# EAGLE design joystick_connector_v1 (EAGLE 9.6.2)
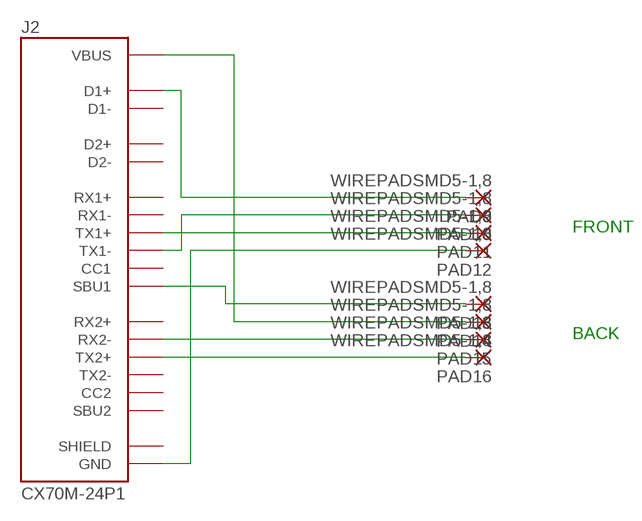
[diagram p0: schematic, sheet 1]

## Parts
J2  CX70M-24P1  [HRS_CX70M-24P1]
PAD9  WIREPADSMD5-1,8  [5-1,8]
PAD10  WIREPADSMD5-1,8  [5-1,8]
PAD11  WIREPADSMD5-1,8  [5-1,8]
PAD12  WIREPADSMD5-1,8  [5-1,8]
PAD13  WIREPADSMD5-1,8  [5-1,8]
PAD14  WIREPADSMD5-1,8  [5-1,8]
PAD15  WIREPADSMD5-1,8  [5-1,8]
PAD16  WIREPADSMD5-1,8  [5-1,8]

## Nets
N$1: J2.A6(D1+) PAD9.1(P)
N$2: J2.A3(TX1-) PAD10.1(P)
N$3: J2.A2(TX1+) PAD11.1(P)
N$4: J2.A1(GND) J2.A12(GND) J2.B1(GND) J2.B12(GND) PAD12.1(P)
N$5: J2.A8(SBU1) PAD13.1(P)
N$6: J2.A4(VBUS) J2.A9(VBUS) J2.B4(VBUS) J2.B9(VBUS) PAD14.1(P)
N$7: J2.A10(RX2-) PAD15.1(P)
N$8: J2.B2(TX2+) PAD16.1(P)
Unconnected: J2.A5(CC1) J2.A7(D1-) J2.A11(RX2+) J2.B3(TX2-) J2.B5(CC2) J2.B6(D2+) J2.B7(D2-) J2.B8(SBU2) J2.B10(RX1-) J2.B11(RX1+)

## Notes on the sheet
- FRONT
- BACK

## Power pins joined to a net without a drawn wire
SHIELD: J2.S1(SHIELD) J2.S2(SHIELD) J2.S3(SHIELD) J2.S4(SHIELD) J2.S5(SHIELD) J2.S5.1(SHIELD) J2.S6(SHIELD) J2.S6.1(SHIELD)

## Library data of the parts
J2 = CX70M-24P1:CX70M-24P1: Usb Connector, 3.1 Type c, Rcpt, Smt; MANUFACTURER: HRS; STANDARD: Manufacturer Recommendations
PAD9-PAD16 = wirepad:WIREPAD: Wire PAD connect wire on PCB

## Board
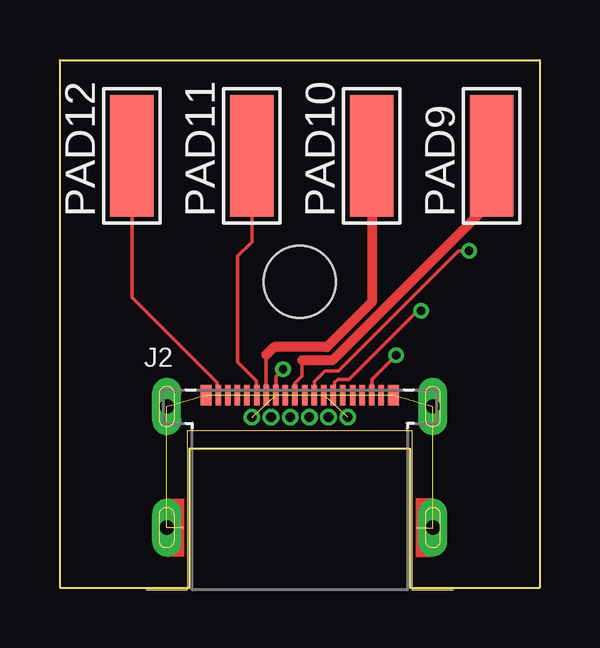
[diagram p1: board, top side]
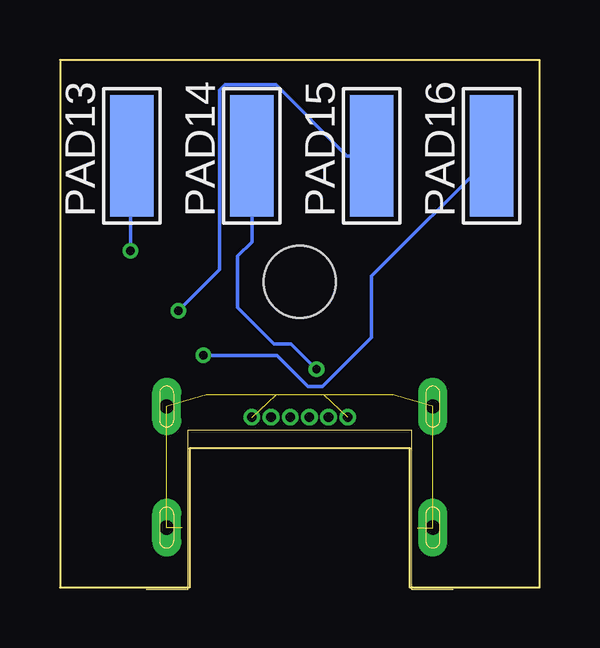
[diagram p2: board, bottom side, seen from below]

Size 20 x 22 mm. Coordinates in mm from the lower left corner, seen from the top.
Outline: 0,0 5.4,0 5.4,5.8 14.6,5.8 14.6,0 20,0 20,22 0,22 0,0
Copper layers (1*16): Top 0.035mm / dielectric 1.53mm / Bottom 0.035mm
Design rules "pban_5mil-l2": minimum track width 5mil, minimum drill 0.3mm, track to track 5mil, track to pad 0.229mm, pad to pad 5mil, via to via 5mil, smd to smd 5mil, copper to edge 0.5mm, drill to drill 0.5mm, minimum pad ring 0.15mm, minimum via ring 0.15mm, stop-mask expansion 4mil, vias tented up to drill 0.35mm, thermal gap 10mil
Holes 3 mm at 10,12.75

### Footprints (pad centres in the part's own frame; a part is rotated, then mirrored left to right if it is on the bottom)
HRS_CX70M-24P1 = smd 0.23 x 0.85: A1 -2.2,5.525; A2 -1.8,5.525; A3 -1.4,5.525; A4 -1,5.525; A5 -0.6,5.525; A6 -0.2,5.525; A7 0.2,5.525; A8 0.6,5.525; A9 1,5.525; A10 1.4,5.525; A11 1.8,5.525; A12 2.2,5.525; B1 3.4,5.525; B2 3,5.525; B3 2.6,5.525; B10 -2.6,5.525; B11 -3,5.525; B12 -3.4,5.525 | drill 0.4 pad 0.6: B4 2,4.6; B5 1.2,4.6; B6 0.4,4.6; B7 -0.4,4.6; B8 -1.2,4.6; B9 -2,4.6 | drill 0.6 pad 1.2 long: S1 -5.55,5.05; S4 5.55,5.05; S5 -5.55,0; S6 5.55,0 | smd 0.46 x 0.85: S2 -3.915,5.525; S3 3.915,5.525 | smd 0.1 x 0.1: S5.1 -4.9,0; S6.1 4.9,0
5-1,8 = smd 1.829 x 5.08: 1 0,0

### Placement (x,y rotation side)
J2  10,2.5 0 top
PAD9  18,18 0 top
PAD10  13,18 0 top
PAD11  8,18 0 top
PAD12  3,18 0 top
PAD13  17,18 0 bottom
PAD14  12,18 0 bottom
PAD15  7,18 0 bottom
PAD16  2,18 0 bottom

### Tracks (layer width: path | path; a pad name or v marks a point on that pad's centre or on a via)
N$1
  Top 0.152: J2.A6 9.8,8.53 10.1,8.82 10.1,9.47
  Top 0.406: 10.1,9.47 11.36,9.47 18,16.11 PAD9.1
N$2
  Top 0.152: 8.6,9.7 J2.A3
  Top 0.406: 8.6,9.7 8.93,10.03 11.13,10.03 13,11.9 PAD10.1
N$3
  Top 0.152: PAD11.1 8,14.42 7.41,13.82 7.41,9.41 8.19,8.62 J2.A2
N$4  (3 unrouted)
  Top 0.152: J2.B12 6.54,8.08 6.54,8.54 3,12.09 PAD12.1
N$5  (via drill 0.35)
  Top 0.152: v17.06,14.04 16.61,14.04 11.61,9.04 11.05,9.04 10.61,8.6 J2.A8
  Bottom 0.152: v17.06,14.04 17.06,17.94 PAD13.1
N$6  (via drill 0.35)  (3 unrouted)
  Top 0.152: J2.A4 9,8.8 v9.3,9.1
  Bottom 0.152: v9.3,9.1 10.36,10.16 11.07,10.16 12.59,11.68 12.59,13.82 12,14.42 PAD14.1
N$7  (via drill 0.35)
  Top 0.152: v15.07,11.53 14.91,11.53 12.05,8.68 11.59,8.68 11.46,8.54 11.46,8.08 J2.A10
  Bottom 0.152: PAD15.1 8.02,18 10.99,20.97 13.11,20.97 13.34,20.73 13.34,13.26 v15.07,11.53
N$8  (via drill 0.35)
  Top 0.152: J2.B2 13,8.67 v14.02,9.68
  Bottom 0.152: PAD16.1 7.01,12.99 7.01,10.43 9.05,8.39 9.65,8.39 10.94,9.68 v14.02,9.68
SHIELD  (7 unrouted)